# EAGLE schematic labwiz-module_pH (EAGLE 6.5.0)

## Sheet 1 of 2
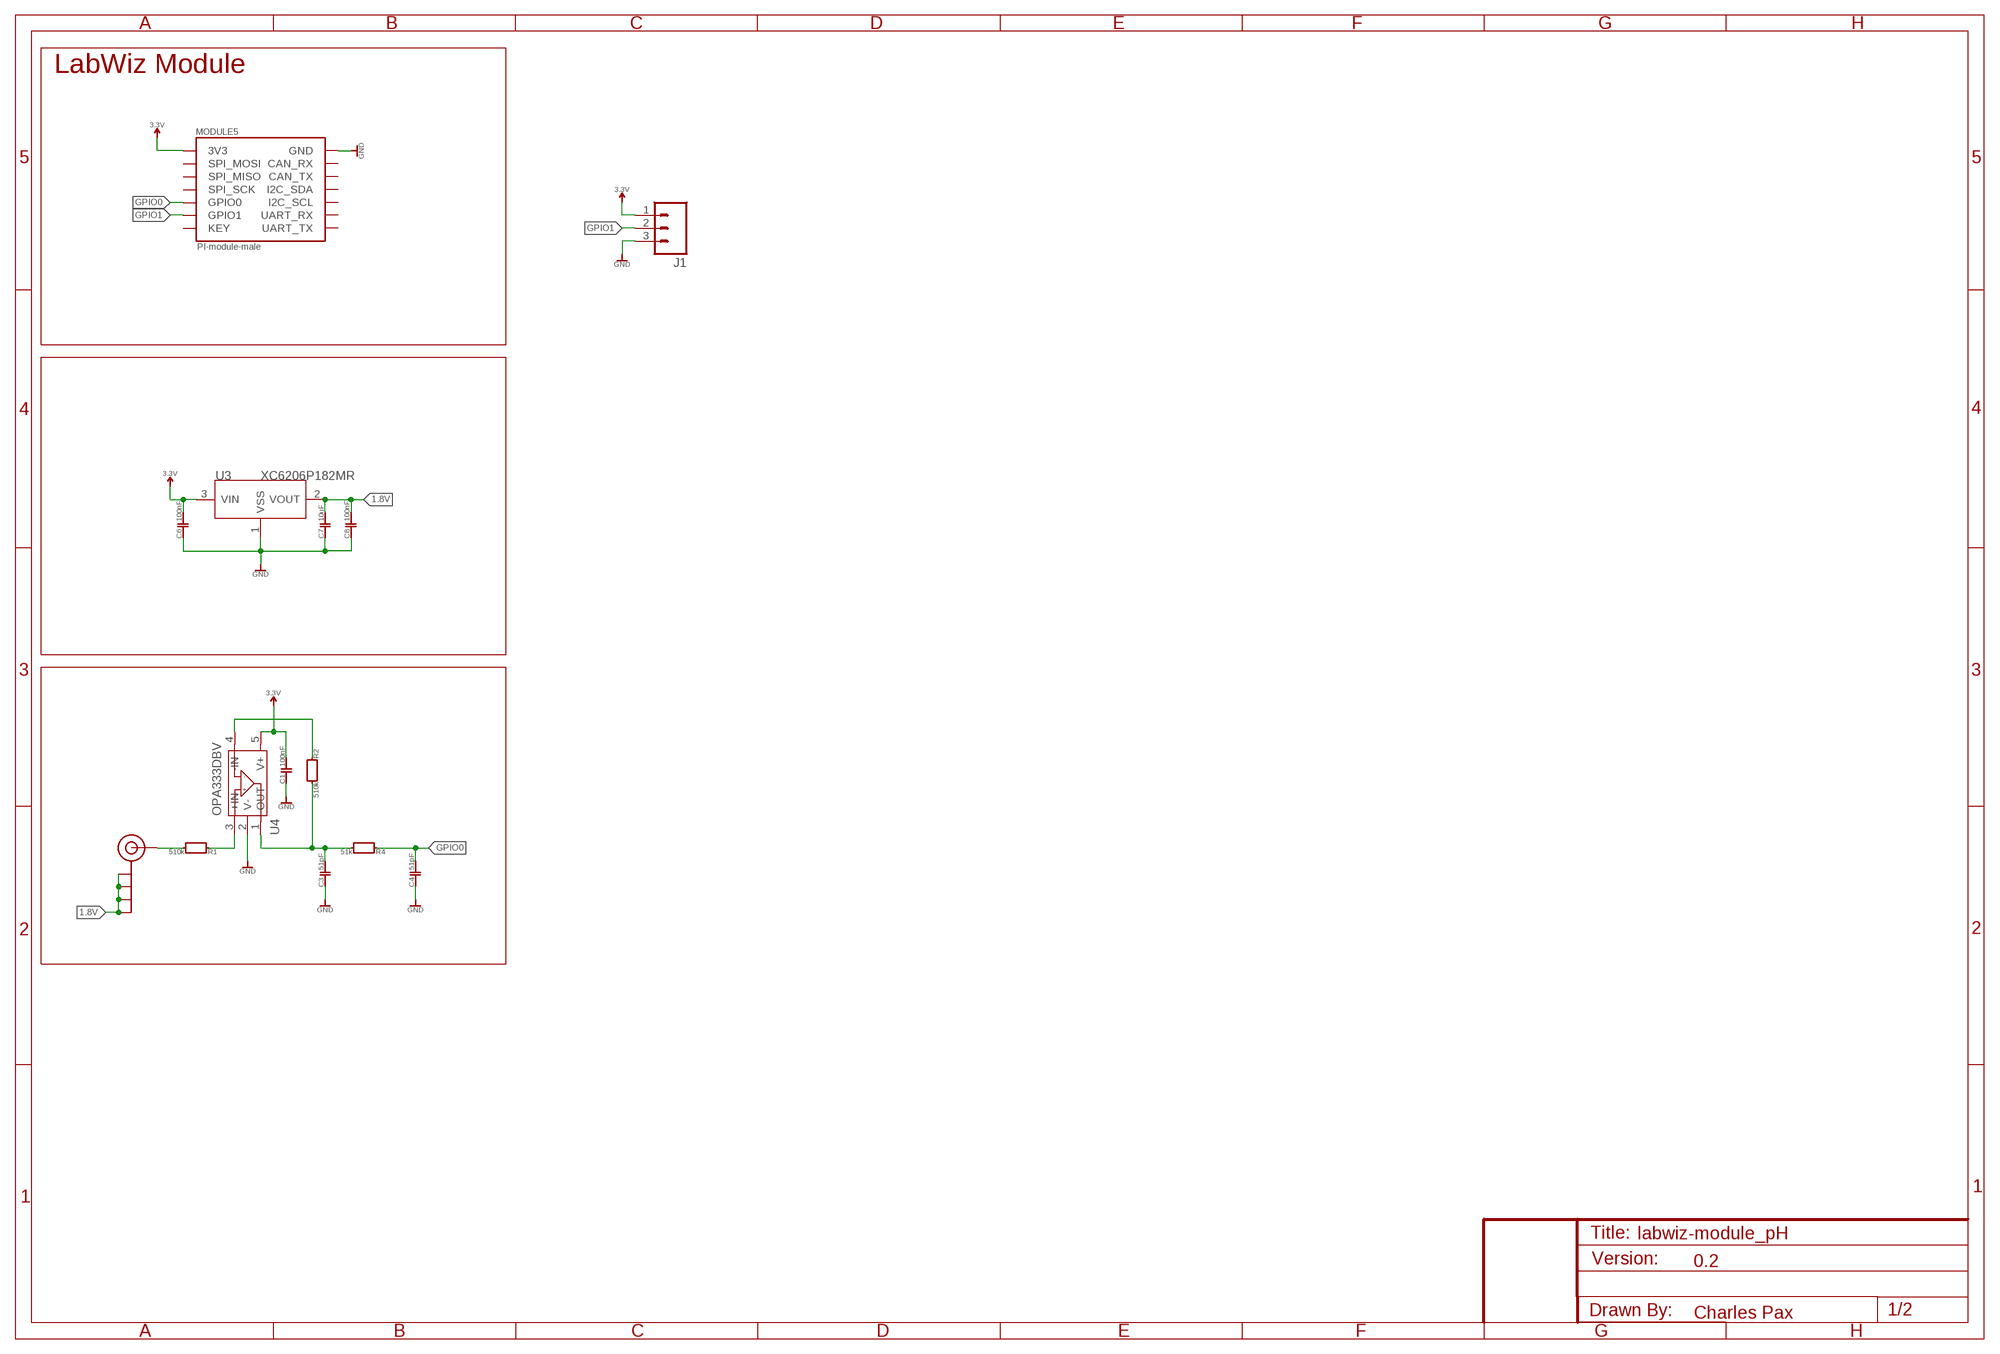
[diagram p0: schematic, sheet 1]

### Parts
C1  100nF  C0402_100NF  [0402]
C3  51pF  C0402  [0402]
C4  51pF  C0402  [0402]
C6  100nF  C0402_100NF  [0402]
C7  10uF  C0402_10UF  [0402]
C8  100nF  C0402_100NF  [0402]
J1  M03LOCK_LONGPADS  [1X03_LOCK_LONGPADS]
J$1  SMA_EDGE  [SMA-EDGE]
MODULE5  PI-module-male  PAX_MODULE_EDGE_MALE_MODULE  [M07X2_2MM_EDGE]
R1  510k  R0402  [0402]
R2  510k  R0402  [0402]
R4  51k  R0402  [0402]
U3  XC6206P182MR  XC6206MR  [SOT23]
U4  OPA333DBV  [SOT23-5]

### Nets
1.8V: C7.2 C8.2 J$1.GND@0(GND) J$1.GND@1(GND) J$1.GND@2(GND) J$1.GND@3(GND) U3.2(VOUT)
3.3V: C1.2 C6.2 J1.1 MODULE5.P$13(3V3) U3.3(VIN) U4.5(V+)
GND: C1.1 C3.1 C4.1 C6.1 C7.1 C8.1 J1.3 MODULE5.P$14(GND) U3.1(VSS) U4.2(V-)
GPIO0: C4.2 MODULE5.P$5(GPIO0) R4.2
GPIO1: J1.2 MODULE5.P$3(GPIO1)
N$4: J$1.SIG(SIGNAL) R1.1
N$12: R1.2 U4.3(+IN)
N$26: R2.2 U4.4(-IN)
N$37: C3.2 R2.1 R4.1 U4.1(OUT)
Unconnected: MODULE5.P$1(KEY) MODULE5.P$2(UART_TX) MODULE5.P$4(UART_RX) MODULE5.P$6(I2C_SCL) MODULE5.P$7(SPI_SCK) MODULE5.P$8(I2C_SDA) MODULE5.P$9(SPI_MISO) MODULE5.P$10(CAN_TX) MODULE5.P$11(SPI_MOSI) MODULE5.P$12(CAN_RX)

### Notes on the sheet
- LabWiz Module
- 0.2
- Charles Pax

## Sheet 2 of 2

## Library data of the parts
C1 C3 C4 C6-C8 = PaxInstruments-RCL:C0402
J1 = SparkFun-Connectors:M03: Header 3 Standard 3-pin 0.1" header. Use with straight break away headers (SKU : PRT-00116), right angle break away headers (PRT-00553), swiss pins (PRT-00743), machine pins (PRT-00117), and female headers (PRT-00115). Molex polarized connector foot print use with SKU : PRT-08232 with associated crimp pins and housings.
J$1 = SparkFun-Connectors:SMA_EDGE: SMA Antenna Connector End launch SMA connector. The paste layer has been removed so that the connector can be hand soldered onto the board after reflow.
MODULE5 = PaxInstruments-Connectors:PAX_MODULE; MF: Pax Instruments; MPN: PIxxxx
R1 R2 R4 = PaxInstruments-RCL:R0402
U3 = IC:XC6206: LOW ESR Cap.Compatible Positive Voltage Regulators
U4 = IC:OPA333: 1.8V,Micro power CMOS oprational amplifiers Zero-Drift Series http://www.ti.com.cn/cn/lit/ds/symlink/opa333.pdf

## Net classes
0 Digital signal: width 0.1 mm, drill 0.2 mm, clearance 0.15 mm
1 3.3V power: width 0.1 mm, drill 0.2 mm, clearance 0.15 mm
2 RTC battery: width 0.1 mm, drill 0.2 mm, clearance 0.15 mm
3 5V power: width 0.1 mm, drill 0.2 mm, clearance 0.15 mm
4 Analog signal: width 0.1 mm, drill 0.2 mm, clearance 0.15 mm
5 GND: width 0.1 mm, drill 0.2 mm, clearance 0.15 mm